# EAGLE design Rocky_Matic_mainboard (EAGLE 6.5.0)
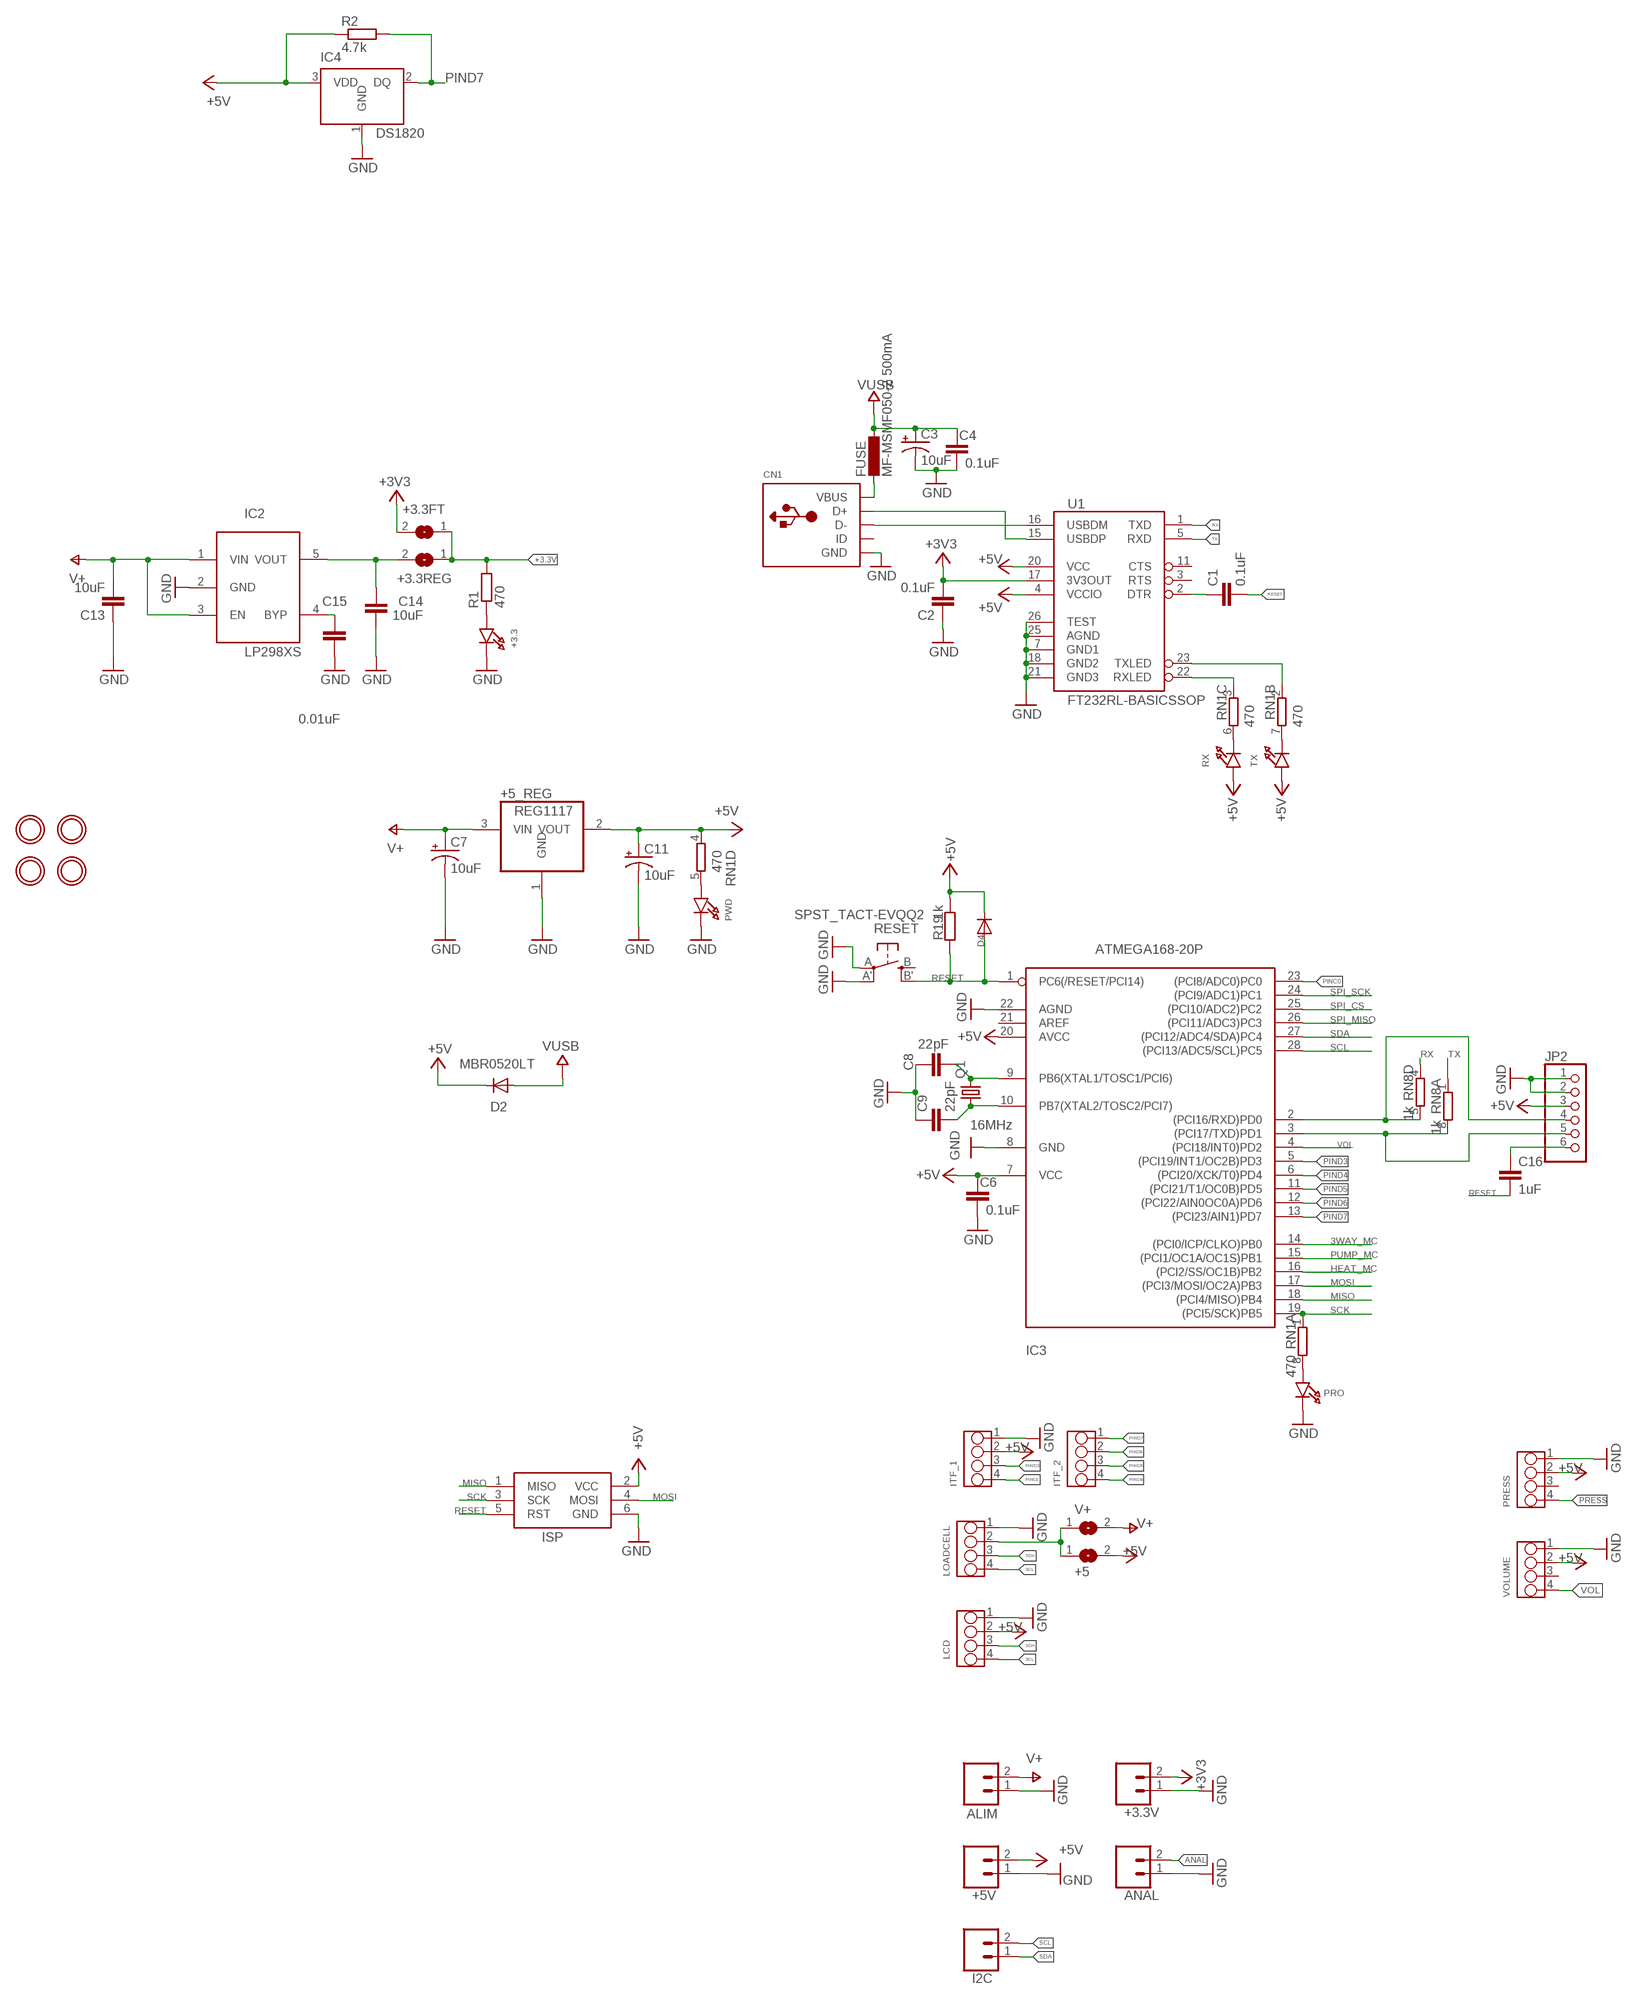
[diagram p0: schematic, sheet 1, part 1 of 2]
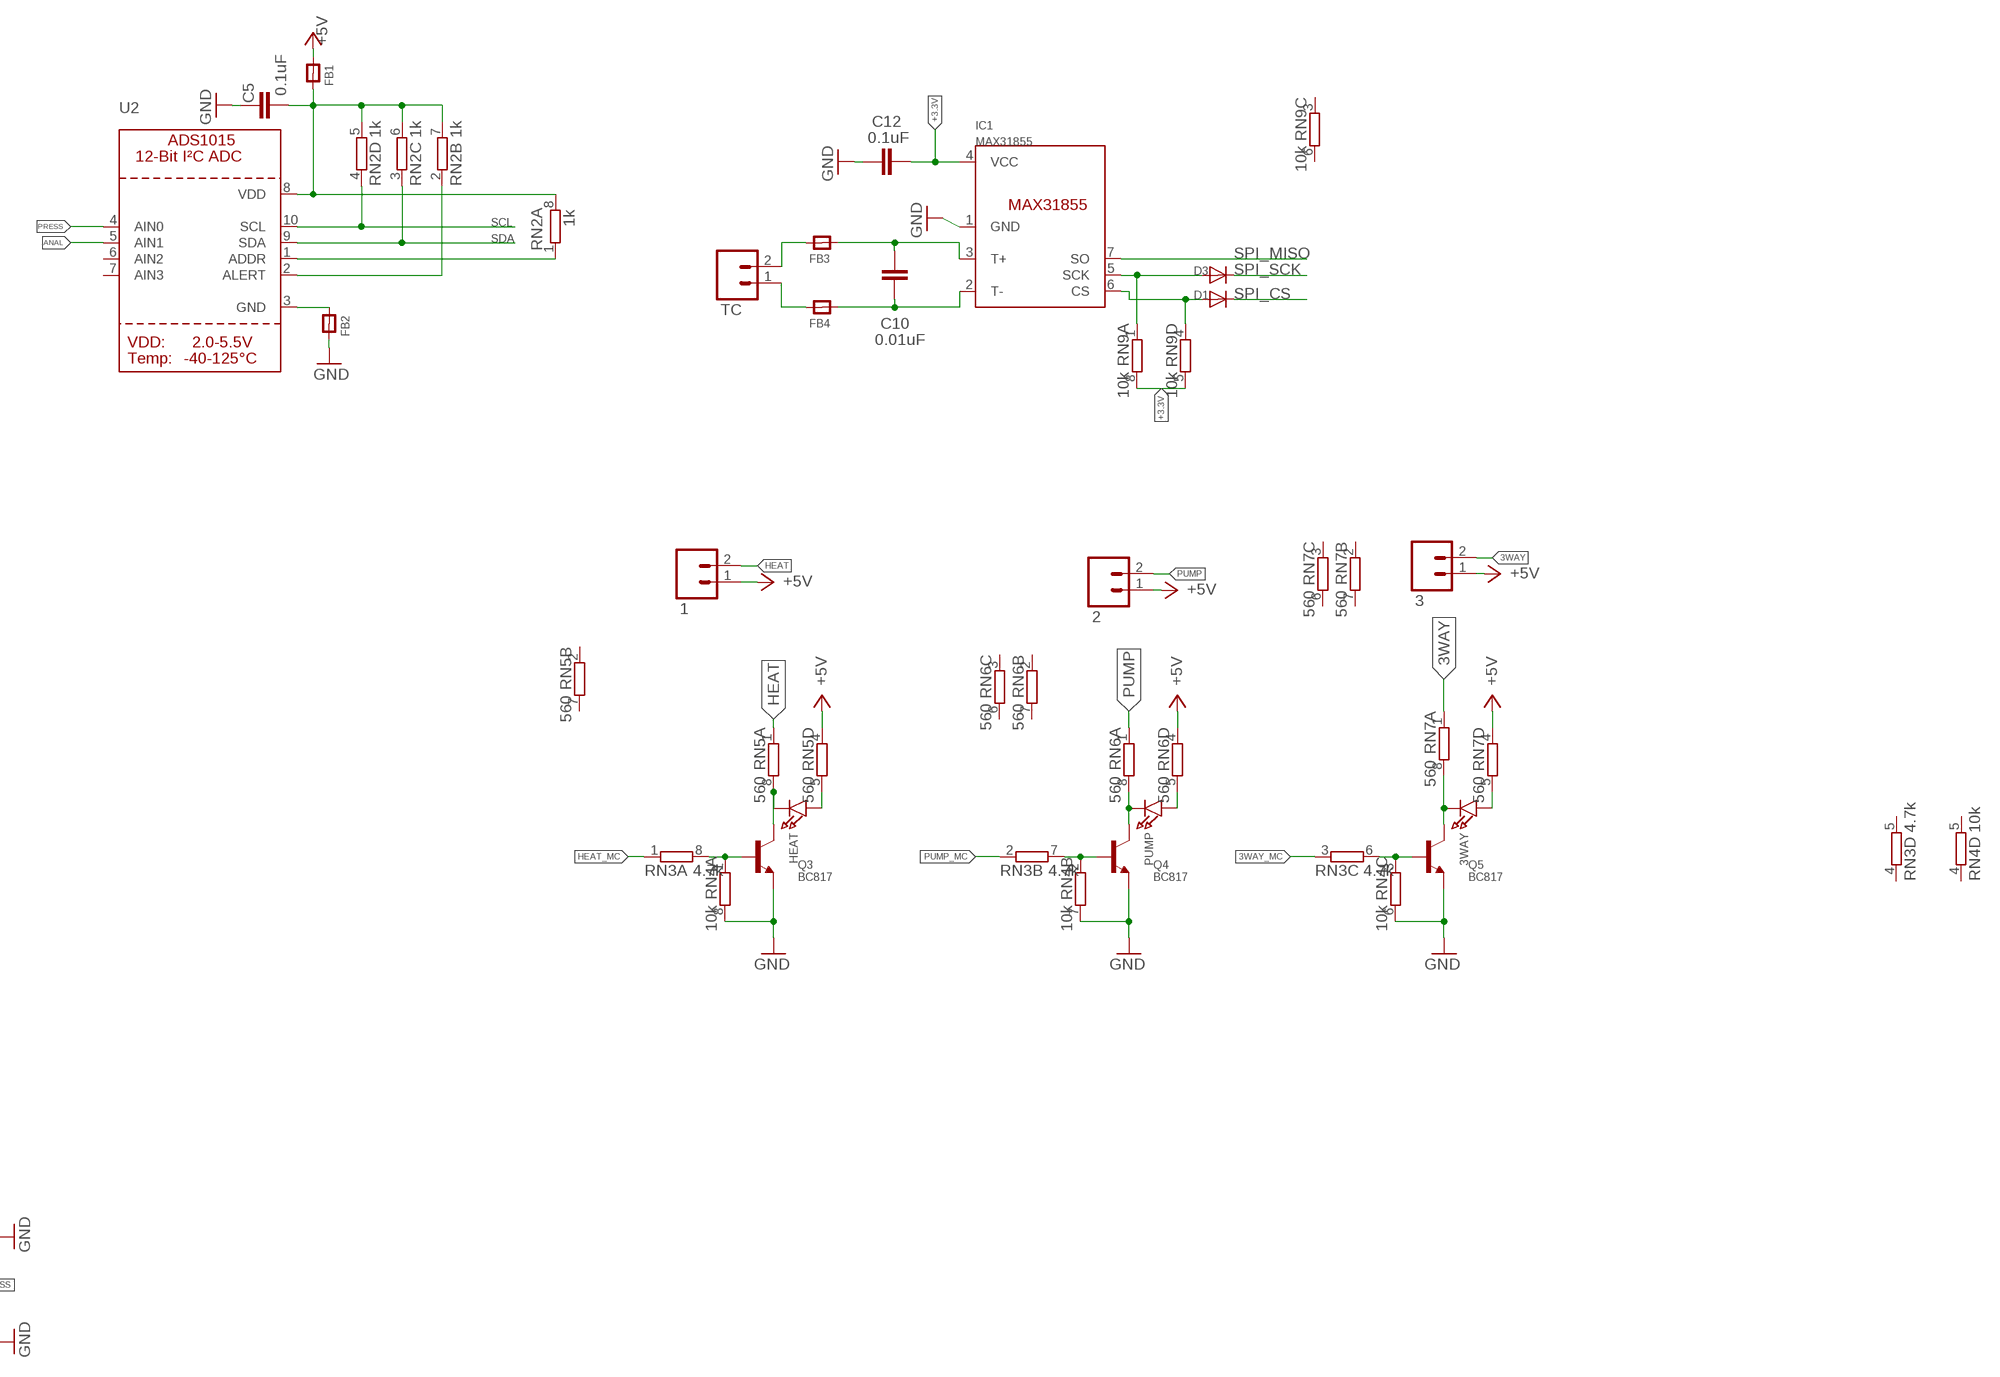
[diagram p1: schematic, sheet 1, part 2 of 2]

## Parts
1  M023.5MM  [SCREWTERMINAL-3.5MM-2]
2  M023.5MM  [SCREWTERMINAL-3.5MM-2]
3  M023.5MM  [SCREWTERMINAL-3.5MM-2]
3WAY  LED0805  [CHIPLED_0805]
+3.3  LED0805  [CHIPLED_0805]
+3.3FT  SJ  [SJ]
+3.3REG  SJ  [SJ]
+3.3V  M023.5MM  [SCREWTERMINAL-3.5MM-2]
+5  SJ  [SJ]
+5_REG  REG1117  [SOT223]
+5V  M023.5MM  [SCREWTERMINAL-3.5MM-2]
ALIM  M023.5MM  [SCREWTERMINAL-3.5MM-2]
ANAL  M023.5MM  [SCREWTERMINAL-3.5MM-2]
C1  0.1uF  C-EUC0805  [C0805]
C2  0.1uF  C-EUC0805  [C0805]
C3  10uF  10UF-16V-10%(TANT)  [EIA3216]
C4  0.1uF  C-EUC0805  [C0805]
C5  0.1uF  C-EUC0805  [C0805]
C6  0.1uF  C-EUC0805  [C0805]
C7  10uF  10UF-16V-10%(TANT)  [EIA3216]
C8  22pF  C-EUC0805  [C0805]
C9  22pF  C-EUC0805  [C0805]
C10  0.01uF  C-EUC0805  [C0805]
C11  10uF  10UF-16V-10%(TANT)  [EIA3216]
C12  0.1uF  C-EUC0805  [C0805]
C13  10uF  C-EUC0805  [C0805]
C14  10uF  C-EUC0805  [C0805]
C15  0.01uF  C-EUC0805  [C0805]
C16  1uF  C-EUC0805  [C0805]
CN1  USBMINIB  [USB-MINIB]
D1  DIODESOD-323F  [SOD-323F]
D2  MBR0520LT  [SOD123]
D3  DIODESOD-323F  [SOD-323F]
D4  DIODESOD-323F  [SOD-323F]
FB1  FERRITE_0805  [_0805]
FB2  FERRITE_0805  [_0805]
FB3  FERRITE_0805  [_0805]
FB4  FERRITE_0805  [_0805]
FUSE  MF-MSMF050-2 500mA  L-EUL1812  [L1812]
HEAT  LED0805  [CHIPLED_0805]
I2C  M023.5MM  [SCREWTERMINAL-3.5MM-2]
IC1  MAX31855  [SOIC8]
IC2  LP298XS  [SOT23-5L]
IC3  ATMEGA168-20P  [DIL28-3]
IC4  DS1820  [TO-92]
ISP  AVRISP-6  [AVRISP]
ITF_1  GROVE-4P-2.0-3470140P1  [4P-2.0-90D]
ITF_2  GROVE-4P-2.0-3470140P1  [4P-2.0-90D]
JP2  PINHD-1X6B  [1X06-BIG]
LCD  GROVE-4P-2.0-3470140P1  [4P-2.0-90D]
LOADCELL  GROVE-4P-2.0-3470140P1  [4P-2.0-90D]
PRESS  GROVE-4P-2.0-3470140P1  [4P-2.0-90D]
PRO  LED0805  [CHIPLED_0805]
PUMP  LED0805  [CHIPLED_0805]
PWD  LED0805  [CHIPLED_0805]
Q1  16MHz  CRYSTALCTS406  [CTS406]
Q3  BC817  TRANSISTOR_NPN  [SOT23-R]
Q4  BC817  TRANSISTOR_NPN  [SOT23-R]
Q5  BC817  TRANSISTOR_NPN  [SOT23-R]
R1  470  R-EU_R0805  [R0805]
R2  4.7k  R-EU_R0805  [R0805]
R19  1k  R-EU_M0805  [M0805]
RESET  SPST_TACT-EVQQ2  [EVQ-Q2]
RN1  470  4R-NCAY16  [CAY16]
RN2  1k  4R-NCAT16  [CAT16]
RN3  4.7k  4R-NCAT16  [CAT16]
RN4  10k  4R-NCAT16  [CAT16]
RN5  560  4R-NCAT16  [CAT16]
RN6  560  4R-NCAT16  [CAT16]
RN7  560  4R-NCAT16  [CAT16]
RN8  1k  4R-NCAY16  [CAY16]
RN9  10k  4R-NCAT16  [CAT16]
RX  LED0805  [CHIPLED_0805]
TC  M023.5MM  [SCREWTERMINAL-3.5MM-2]
TX  LED0805  [CHIPLED_0805]
U1  FT232RL-BASICSSOP  [SSOP28DB]
U2  ADC_ADS1015  [MSOP10]
U$1  MOUNTINGHOLE3.0THIN  [MOUNTINGHOLE_3.0_PLATEDTHIN]
U$2  MOUNTINGHOLE3.0THIN  [MOUNTINGHOLE_3.0_PLATEDTHIN]
U$3  MOUNTINGHOLE3.0THIN  [MOUNTINGHOLE_3.0_PLATEDTHIN]
U$4  MOUNTINGHOLE3.0THIN  [MOUNTINGHOLE_3.0_PLATEDTHIN]
V+  SJ  [SJ]
VOLUME  GROVE-4P-2.0-3470140P1  [4P-2.0-90D]

## Nets
3WAY: 3.2 RN7.1
3WAY_MC: IC3.14((PCI0/ICP/CLKO)PB0) RN3.3
+3.3V: +3.3FT.1 +3.3REG.1 C12.2 IC1.4(VCC) R1.2 RN9.5 RN9.8
+3V3: +3.3FT.2 +3.3V.2 C2.2 U1.17(3V3OUT)
+5V: 1.1 2.1 3.1 +5.2 +5_REG.2(VOUT) +5V.2 C6.2 C11.A(+) D2.C D4.C FB1.1 IC3.7(VCC) IC3.20(AVCC) IC4.3(VDD) ISP.2(VCC) ITF_1.2 JP2.3 LCD.2 PRESS.2 R2.1 R19.2 RN1.4 RN5.4 RN6.4 RN7.4 RX.A TX.A U1.4(VCCIO) U1.20(VCC) VOLUME.2
ANAL: ANAL.2 U2.5(AIN1)
GND: +3.3.C +3.3V.1 +5V.1 ALIM.1 ANAL.1 C2.1 C3.C(-) C4.1 C5.2 C6.1 C7.C(-) C8.1 C9.1 C11.C(-) C12.1 C13.1 C14.1 C15.1 CN1.GND FB2.2 IC1.1(GND) IC2.2(GND) IC3.8(GND) IC3.22(AGND) IC4.1(GND) ISP.6(GND) ITF_1.1 JP2.1 JP2.2 LCD.1 LOADCELL.1 PRESS.1 PRO.C PWD.C Q3.2(E) Q4.2(E) Q5.2(E) RESET.A'(P1) RESET.A(P) RN4.6 RN4.7 RN4.8 U1.7(GND1) U1.18(GND2) U1.21(GND3) U1.25(AGND) U1.26(TEST) VOLUME.1
HEAT: 1.2 RN5.1
HEAT_MC: IC3.16((PCI2/SS/OC1B)PB2) RN3.1
MISO: IC3.18((PCI4/MISO)PB4) ISP.1(MISO)
MOSI: IC3.17((PCI3/MOSI/OC2A)PB3) ISP.4(MOSI)
N$1: Q3.1(B) RN3.8 RN4.1
N$2: C8.2 IC3.9(PB6(XTAL1/TOSC1/PCI6)) Q1.3
N$3: HEAT.C Q3.3(C) RN5.8
N$4: C9.2 IC3.10(PB7(XTAL2/TOSC2/PCI7)) Q1.1
N$5: HEAT.A RN5.5
N$6: CN1.VBUS FUSE.2
N$7: Q4.1(B) RN3.7 RN4.2
N$8: PUMP.C Q4.3(C) RN6.8
N$9: PUMP.A RN6.5
N$10: RN1.7 TX.C
N$11: Q5.1(B) RN3.6 RN4.3
N$12: PWD.A RN1.5
N$13: 3WAY.C Q5.3(C) RN7.8
N$14: 3WAY.A RN7.5
N$15: RN1.6 RX.C
N$16: FB2.1 U2.3(GND)
N$17: RN1.3 U1.22(RXLED)
N$18: RN1.2 U1.23(TXLED)
N$19: CN1.D+ U1.15(USBDP)
N$20: C1.1 U1.2(DTR)
N$21: CN1.D- U1.16(USBDM)
N$22: RN2.1 U2.1(ADDR)
N$23: IC3.2((PCI16/RXD)PD0) JP2.4 RN8.5
N$24: IC3.3((PCI17/TXD)PD1) JP2.5 RN8.8
N$25: RN2.2 U2.2(ALERT)
N$26: PRO.A RN1.8
N$28: C10.1 FB3.1 IC1.3(T+)
N$29: C10.2 FB4.1 IC1.2(T-)
N$30: C5.1 FB1.2 RN2.5 RN2.6 RN2.7 RN2.8 U2.8(VDD)
N$31: FB3.2 TC.2
N$32: FB4.2 TC.1
N$33: D3.A IC1.5(SCK) RN9.1
N$34: D1.A IC1.6(CS) RN9.4
N$35: +5.1 LOADCELL.2 V+.1
N$36: +3.3.A R1.1
N$37: +3.3REG.2 C14.2 IC2.5(VOUT)
N$38: C15.2 IC2.4(BYP)
N$44: C16.1 JP2.6
PINC0: IC3.23((PCI8/ADC0)PC0) ITF_1.4
PIND3: IC3.5((PCI19/INT1/OC2B)PD3) ITF_1.3
PIND4: IC3.6((PCI20/XCK/T0)PD4) ITF_2.4
PIND5: IC3.11((PCI21/T1/OC0B)PD5) ITF_2.3
PIND6: IC3.12((PCI22/AIN0OC0A)PD6) ITF_2.2
PIND7: IC3.13((PCI23/AIN1)PD7) IC4.2(DQ) ITF_2.1 R2.2
PRESS: PRESS.4 U2.4(AIN0)
PUMP: 2.2 RN6.1
PUMP_MC: IC3.15((PCI1/OC1A/OC1S)PB1) RN3.2
RESET: C1.2 C16.2 D4.A IC3.1(PC6(/RESET/PCI14)) ISP.5(RST) R19.1 RESET.B'(S1)
RX: RN8.4 U1.1(TXD)
SCK: IC3.19((PCI5/SCK)PB5) ISP.3(SCK) RN1.1
SCL: I2C.2 IC3.28((PCI13/ADC5/SCL)PC5) LCD.4 LOADCELL.4 RN2.4 U2.10(SCL)
SDA: I2C.1 IC3.27((PCI12/ADC4/SDA)PC4) LCD.3 LOADCELL.3 RN2.3 U2.9(SDA)
SPI_CS: D1.C IC3.25((PCI10/ADC2)PC2)
SPI_MISO: IC1.7(SO) IC3.26((PCI11/ADC3)PC3)
SPI_SCK: D3.C IC3.24((PCI9/ADC1)PC1)
TX: RN8.1 U1.5(RXD)
V+: +5_REG.3(VIN) ALIM.2 C7.A(+) C13.2 IC2.1(VIN) IC2.3(EN) V+.2
VOL: IC3.4((PCI18/INT0)PD2) VOLUME.4
VUSB: C3.A(+) C4.2 D2.A FUSE.1
Unconnected: CN1.ID IC3.21(AREF) PRESS.3 RESET.B(S) RN3.4 RN3.5 RN4.4 RN4.5 RN5.2 RN5.3 RN5.6 RN5.7 RN6.2 RN6.3 RN6.6 RN6.7 RN7.2 RN7.3 RN7.6 RN7.7 RN8.2 RN8.3 RN8.6 RN8.7 RN9.2 RN9.3 RN9.6 RN9.7 U1.3(RTS) U1.11(CTS) U2.6(AIN2) U2.7(AIN3) VOLUME.3

## Power pins joined to a net without a drawn wire
GND: +5_REG.1(GND)

## Library data of the parts
1-3 +3.3V +5V ALIM ANAL I2C TC = SparkFun-Connectors:M02: Standard 2-pin 0.1" header. Use with - straight break away headers ( PRT-00116) - right angle break away headers (PRT-00553) - swiss pins (PRT-00743) - machine pins (PRT-00117) - female headers (PRT-00115) Molex polarized connector foot print use with: PRT-08233 with associated crimp pins and housings. 2.54_SCREWTERM for use with PRT-10571. 3.5mm Screw Terminal footprints for PRT-08084 5mm Screw Terminal footprints for use with PRT-08433
3WAY +3.3 HEAT PRO PUMP PWD RX TX = microbuilder:LED: LED 0603 - 0603 Surface Mount Package 2mA: Green LED - Low Power (3.9mcd, 2ma, 1.7Vf) - Digikey: 475-2709-2-ND Orange LED - Low Power (9.8mcd, 2ma, 1.8Vf) - Digikey: 475-1194-2-ND Red LED - Low Power (5mcd, 2ma, 1.8Vf) - Digikey: 475-1195-2-ND Yellow LED - Low Power (7mcd, 2ma, 1.8Vf) - Digikey: 475-1196-2-ND 5mA: Blue LED - Low Power (17mcd, 5ma, 2.9Vf) - Digikey: LNJ937W8CRACT-ND 0805 - 0805 Surface Mount Package 2mA: Red LED (8.8mcd, 2mA, 1.8Vf, Clear) - Low Power [Digikey: 475-2510-1-ND] Green LED (5mcd, 2mA, 1.8Vf, Clear) - Low Power [Digikey: 475-2730-1-ND] Yellow LED (11.3mcd, 2mA, 1.8Vf, Clear) - Low Power [Digikey: 475-2555-1-ND] 20mA: Red LED (104mcd, 20mA, Diffused) - LS R976 [Digikey: 475-1278-6-ND] Red LED (12mcd, 20mA, 2.0Vf, Clear) - APT2012EC [Digikey: 754-1128-1-ND] Green LED (15mcd, 20mA, 2.2Vf, Clear) - APT2012GC [Digikey: 754-1131-1-ND] Orange LED (160mcd, 20mA, 2.1Vf, Clear) - APT2012SECK [Digikey: 754-1130-1-ND] 1206 - 1206 Surface Mount Package Green LED (26mcd, 20mA, Diffused) - LG N971 [Digikey: 475-1407-6-ND] Red LED (15mcd, 20mA, Diffused) - LH N974 [Digikey: 475-1416-6-ND]
+3.3FT +3.3REG +5 V+ = jumper:SJ: SMD solder JUMPER
+5_REG = burr-brown:REG1117: 800mA and 1A Low Dropout (LDO) Positive Regulator 1.8V, 2.5V, 2.85V, 3.3V, 5V, and Adj; MPN: REG1117; OC_FARNELL: 1097566; OC_NEWARK: 14P6981
C1 C2 C4-C6 C8-C10 C12-C16 = rcl:C-EU: CAPACITOR, European symbol
C3 C7 C11 = SparkFun-Capacitors:10UF-16V-10%(TANT): CAP-00811 1206/EIA-3216 Tantalum capacitor; PROD_ID: CAP-00811
CN1 = adafruit:USB: USB Connectors USBMINIB - Surface Mount Female Mini-B USB Connector 4UConnector: 06564 By microbuilder.eu Thru-hole RA Female Mini-B USB Connector 4UConnector: 18732 By ladyada.net
D1 D3 D4 = adafruit:DIODE: Diode SMADIODE - SMA Surface Mount Package 20V 1A Schottky Diode Digikey: 641-1014-6-ND DO-1N4148 - Through Hole Small Current Diode SOD-123 20V 1 A (.5mV Vf) Schottky Diode - Digikey: MBRX120TPMSCT-ND SOD-323 10V 570mA (.38mV Vf, 3ns) Schottky Diode - Digikey: ZLLS410CT-ND SOD-523 30V 30mA Schottky Diode (RB751S-40TE61) - Digikey: RB751S-40TE61CT-ND SOT23-R/W - SOT23 Package (R = Solder Paste/Reflow Ovens, W = Hand-Soldering) BAT54Film 40V 300mA - Digikey: 497-7162-1-ND
D2 = diode:MBR0520LT: SCHOTTKY BARRIER RECTIFIER Source: http://onsemi.com .. MBR0520LT1-D.pdf
FB1-FB4 = microbuilder:FERRITE: Ferrite Bead 0603 MMZ1608B121C - 120 Ohm @ 100MHz, 600mA, 0.15 Ohm DC Resistance - Digikey: 445-2164-1-ND BK1608HW121-T - 120 Ohm, 600mA Ferrite Chip - Digikey: 587-1876-2-ND 0805 HZ0805B272R-10 - 2.7K Ohm @ 100MHz, 200mA, 0.8 Ohm DC Resistance - Digikey: 240-2504-1-ND (see also Murata BLM21BD272SN1L) MMZ2012Y152B - 1.5K Ohm @ 100MHz, 500mA, 0.4 Ohm DC Resistance - Digikey: 445-1560-1-ND - Mainly for high frequency (80-400MHz) MMZ2012R102A - 1K Ohm @ 100MHz, 500mA, 0.3 Ohm DC Resistance - Digikey: 445-1555-2-ND - More general purpose (10-200MHz)
FUSE = rcl:L-EU: INDUCTOR, European symbol
IC1 = AlexW-Eagle-Libraries:MAX31855
IC2 = adafruit:LP298X
IC3 = adafruit:ATMEGA168*P: MICROCONTROLLER 16 kBytes FLASH 1 kBytes SRAM 512 Bytes EEPROM USART 8-channel 10 bit ADC
IC4 = DS1820:DS1820: DS1820 - 1-Wire Digital Thermometer
ISP = adafruit:AVRISP: AVR ISP HEADER Standard 6 pin header for AVR programming
ITF_1 ITF_2 LCD LOADCELL PRESS VOLUME = OPL Eagle Library:GROVE-4P-2.0
JP2 = adafruit:PINHD-1X6: PIN HEADER
Q1 = adafruit:CRYSTAL: CRYSTAL; OC_FARNELL: unknown; OC_NEWARK: unknown
Q3-Q5 = microbuilder:TRANSISTOR_NPN: NPN Transistor Transistor (NPN) 500mA 45V - BC817 [Digikey: 568-1631-1-ND] Transistor (NPN) 500mA 45V - BC817,215 [Mouser: 771-BC817-T/R] SOT23-R - SOT23 footprint optimised for use with solder paste and reflow ovens. SOT23-W - SOT23 footprint optimised for hand-soldering (larger pads).
R1 R2 R19 = rcl:R-EU_: RESISTOR, European symbol
RESET = adafruit:SPST_TACT: SMT 6mm switch, EVQQ2 series http://www.ladyada.net/library/eagle
RN1-RN9 = resistor-dil:4R-N: Array Chip Resistor Source: RS Component / Phycomp; OC_FARNELL: unknown; OC_NEWARK: unknown
U1 = SparkFun-DigitalIC:FT232RL-BASIC: USB UART This is the simplified version of the FT232RL unit. Only what you need, nothing you don't. Spark Fun Electronics SKU : COM-00650
U2 = microbuilder:ADC_ADS1015: ADS1015 - 12-bit 4-Channel I2C ADC with Internal PGA VDD: 2.0-5.5V Sampling Rate: 3.3ksps Gain Settings: 2/3, 1, 2, 4, 8, 16 I2C Address: ADDR low = 1001000x, ADDR high = 1001001x Internal Comparator The ADS1015 includes an internal comparator that can be set to output a high-level on ALERT when the conversion results exceeeds a pre-defined upper level, and will deassert itself when the level falls below a pre-defined lower threshold level. It can also be set to windowed mode where the ALERT pin will be asserted if the data exceeds the upper threshold or falls below the lower threshold.
U$1-U$4 = microbuilder:MOUNTINGHOLE: Mounting Hole For #2 screws (0.086"/2.18mm width, 0.094"/2.4mm hole) use 2.5mm

## Board
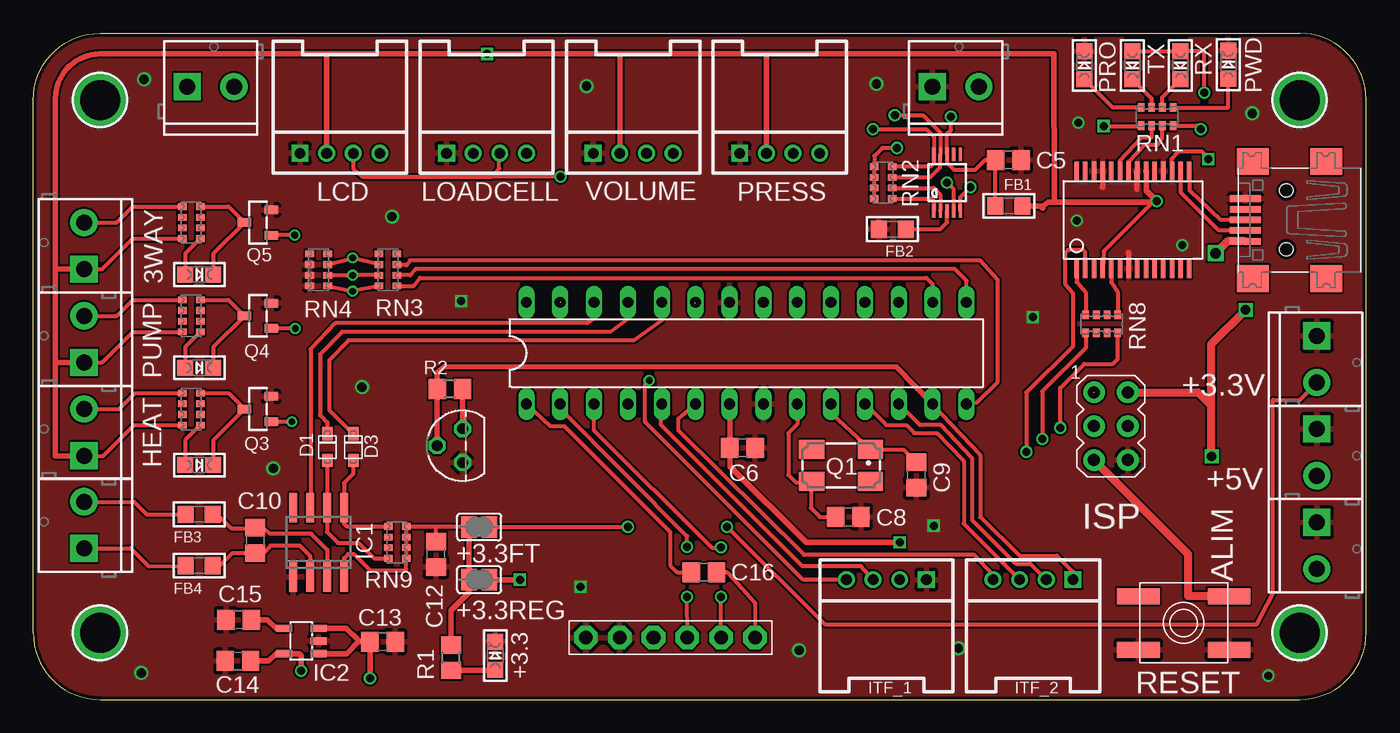
[diagram p2: board, top side]
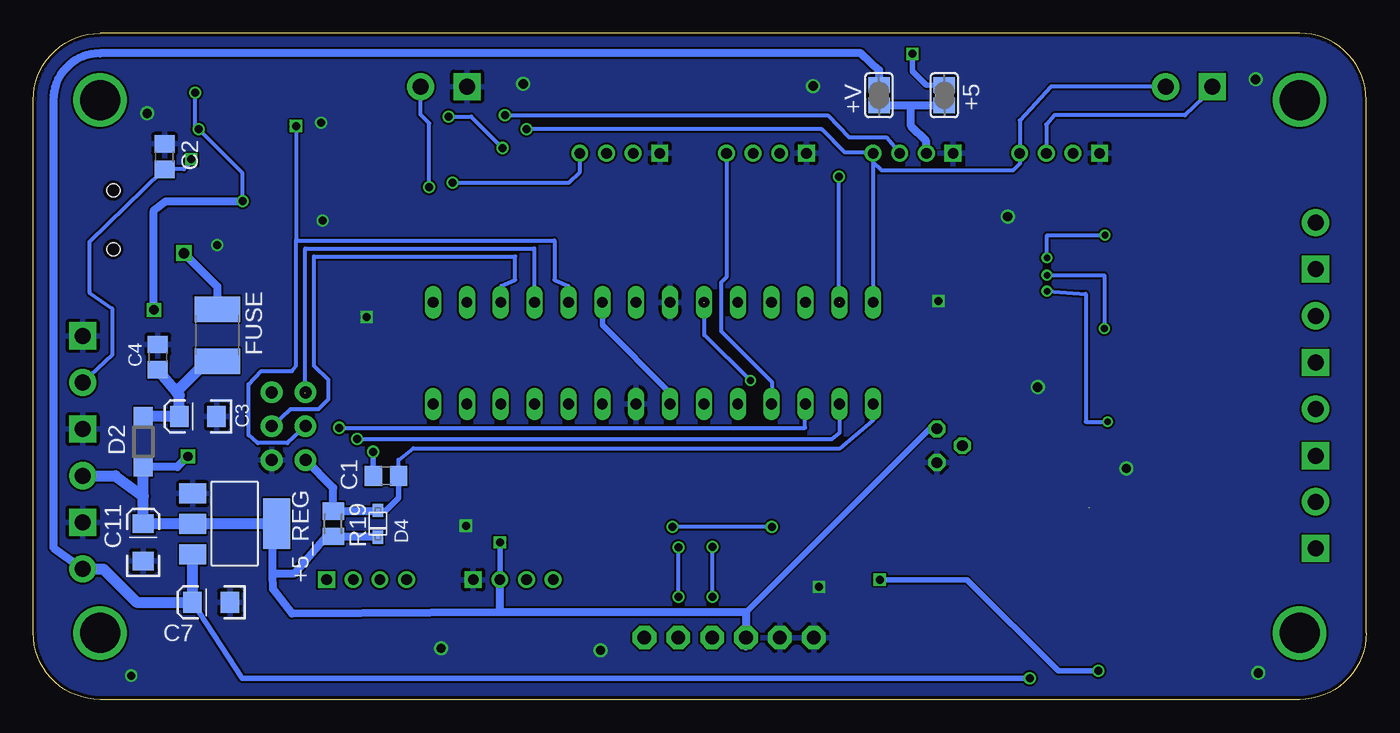
[diagram p3: board, bottom side, seen from below]

Size 100 x 50 mm. Coordinates in mm from the lower left corner, seen from the top.
Outline: 5,0 95,0 arc90 100,5 100,45 arc90 95,50 5,50 arc90 0,45 0,5 arc90 5,0
Copper layers (1*2*15*16): Top 0.035mm / dielectric 0.2mm / Route2 0.0175mm / dielectric 1.1mm / Route15 0.0175mm / dielectric 0.2mm / Bottom 0.035mm
Design rules "SeeedStudio_DRU_no_angle_20130527": minimum track width 6mil, minimum drill 12mil, track to track 6mil, track to pad 6mil, pad to pad 6mil, via to via 6mil, smd to smd 0mil, copper to edge 10mil, drill to drill 10mil, minimum pad ring 6mil, minimum via ring 6mil, stop-mask expansion 2mil, vias tented up to drill 25mil, thermal gap 10mil

### Footprints (pad centres in the part's own frame; a part is rotated, then mirrored left to right if it is on the bottom)
SCREWTERMINAL-3.5MM-2 = drill 1.2 pad 2.032 square: 1 0,0 | drill 1.2 pad 2.032: 2 3.5,0
CHIPLED_0805 = smd 1.2 x 1.2: A 0,-1.05; C 0,1.05
SJ = smd 1.168 x 1.6: 1 -0.762,0; 2 0.762,0
SOT223 = smd 1.499 x 2.007: 1 -2.261,-3.15; 2 0.025,-3.15; 3 2.311,-3.15 | smd 3.81 x 2.007: 4 0,3.15
C0805 = smd 1.3 x 1.5: 1 -0.95,0; 2 0.95,0
EIA3216 = smd 1.4 x 1.6: A 1.4,0; C -1.4,0
USB-MINIB = smd 0.5 x 2.308: D+ 0,4.064; D- -0.8,4.064; GND 1.6,4.064; ID 0.8,4.064; VBUS -1.6,4.064 | smd 2 x 2.4: GND1 -4.4,-2; GND2 -4.4,3.5; GND3 4.4,3.5; GND4 4.4,-2 | hole 1: -2.2,1; 2.2,1
SOD-323F = smd 1 x 0.8: A -1,0; C 1,0
SOD123 = smd 1.4 x 1.4: A 1.9,0; C -1.9,0
_0805 = smd 1.2 x 1.3: 1 -1.016,0; 2 1.016,0
L1812 = smd 1.9 x 3.4: 1 -1.95,0; 2 1.95,0
SOIC8 = smd 0.6 x 2.2: 1 -1.905,-2.6; 2 -0.635,-2.6; 3 0.635,-2.6; 4 1.905,-2.6; 5 1.905,2.6; 6 0.635,2.6; 7 -0.635,2.6; 8 -1.905,2.6
SOT23-5L = smd 0.55 x 1.2: 1 -0.95,-1.3; 2 0,-1.3; 3 0.95,-1.3; 4 0.95,1.3; 5 -0.95,1.3
DIL28-3 = drill 0.813 long: 1 -16.51,-3.81; 2 -13.97,-3.81; 3 -11.43,-3.81; 4 -8.89,-3.81; 5 -6.35,-3.81; 6 -3.81,-3.81; 7 -1.27,-3.81; 8 1.27,-3.81; 9 3.81,-3.81; 10 6.35,-3.81; 11 8.89,-3.81; 12 11.43,-3.81; 13 13.97,-3.81; 14 16.51,-3.81; 15 16.51,3.81; 16 13.97,3.81; 17 11.43,3.81; 18 8.89,3.81; 19 6.35,3.81; 20 3.81,3.81; 21 1.27,3.81; 22 -1.27,3.81; 23 -3.81,3.81; 24 -6.35,3.81; 25 -8.89,3.81; 26 -11.43,3.81; 27 -13.97,3.81; 28 -16.51,3.81
TO-92 = drill 0.813 pad 1.27 octagon: 1 -1.27,0; 2 0,1.905; 3 1.27,0
AVRISP = drill 0.9 pad 1.626: 1 -1.27,2.54; 2 1.27,2.54; 3 -1.27,0; 4 1.27,0; 5 -1.27,-2.54; 6 1.27,-2.54
4P-2.0-90D = drill 0.8 pad 1.27 square: 1 -3,0 | drill 0.8 pad 1.27: 2 -1,0; 3 1,0; 4 3,0
1X06-BIG = drill 1.016 pad 1.778 octagon: 1 -6.35,0; 2 -3.81,0; 3 -1.27,0; 4 1.27,0; 5 3.81,0; 6 6.35,0
CTS406 = smd 1.9 x 1.4: 1 -2.2,-1.2; 2 2.2,-1.2; 3 2.2,1.2; 4 -2.2,1.2
SOT23-R = smd 0.635 x 1.016: 1 -0.95,-1; 2 0.95,-1; 3 0,1
R0805 = smd 1.3 x 1.5: 1 -0.95,0; 2 0.95,0
M0805 = smd 1.3 x 1.6: 1 -0.95,0; 2 0.95,0
EVQ-Q2 = smd 3.2 x 1.2: A -3.4,-2; A' 3.4,-2; B -3.4,2; B' 3.4,2
CAY16 = smd 0.5 x 0.65: 1 -1.2,-0.675; 2 -0.4,-0.675; 3 0.4,-0.675; 4 1.2,-0.675; 5 1.2,0.675; 6 0.4,0.675; 7 -0.4,0.675; 8 -1.2,0.675
CAT16 = smd 0.5 x 0.65: 1 -1.2,-0.675; 2 -0.4,-0.675; 3 0.4,-0.675; 4 1.2,-0.675; 5 1.2,0.675; 6 0.4,0.675; 7 -0.4,0.675; 8 -1.2,0.675
SSOP28DB = smd 0.348 x 1.397: 1 -4.225,-3.656; 2 -3.575,-3.656; 3 -2.925,-3.656; 4 -2.275,-3.656; 5 -1.625,-3.656; 6 -0.975,-3.656; 7 -0.325,-3.656; 8 0.325,-3.656; 9 0.975,-3.656; 10 1.625,-3.656; 11 2.275,-3.656; 12 2.925,-3.656; 13 3.575,-3.656; 14 4.225,-3.656; 15 4.225,3.656; 16 3.575,3.656; 17 2.925,3.656; 18 2.275,3.656; 19 1.625,3.656; 20 0.975,3.656; 21 0.325,3.656; 22 -0.325,3.656; 23 -0.975,3.656; 24 -1.625,3.656; 25 -2.275,3.656; 26 -2.925,3.656; 27 -3.575,3.656; 28 -4.225,3.656
MSOP10 = smd 0.25 x 1: 1 -1,-2.113; 2 -0.5,-2.113; 3 0,-2.113; 4 0.5,-2.113; 5 1,-2.113; 6 1,2.113; 7 0.5,2.113; 8 0,2.113; 9 -0.5,2.113; 10 -1,2.113
MOUNTINGHOLE_3.0_PLATEDTHIN = drill 3 pad 3.6: P$1 0,0

### Placement (x,y rotation side)
1  3.8,18.3 90 top
2  3.8,25.3 90 top
3  3.8,32.3 90 top
3WAY  12.45,31.9 270 top
+3.3  34.65,3.3 0 top
+3.3FT  33.45,12.95 0 top
+3.3REG  33.45,9 0 top
+3.3V  96.3,27.3 270 top
+5  31.65,45.35 90 bottom
+5_REG  84.9,13.2 270 bottom
+5V  96.3,20.3 270 top
ALIM  96.3,13.3 270 top
ANAL  67.45,46 0 top
C1  73.55,16.8 0 bottom
C2  90.15,40.75 270 bottom
C3  87.65,21.25 180 bottom
C4  90.65,25.7 270 bottom
C5  73.15,40.5 0 top
C6  53.2,18.9 180 top
C7  86.65,7.3 180 bottom
C8  61.15,13.71 180 top
C9  66.24,16.85 90 top
C10  16.65,11.95 270 top
C11  91.75,11.8 90 bottom
C12  30.2,10.9 90 top
C13  26.2,4.35 180 top
C14  15.35,2.9 0 top
C15  15.4,6 0 top
C16  50.3,9.55 180 top
CN1  95,36 90 top
D1  22.05,18.95 90 top
D2  91.75,19.35 90 bottom
D3  24,18.95 90 top
D4  74.15,13.2 270 bottom
FB1  73.2,37.05 180 top
FB2  64.45,35.3 180 top
FB3  12.45,13.9 180 top
FB4  12.45,10.05 180 top
FUSE  86.2,27.35 90 bottom
HEAT  12.45,17.6 270 top
I2C  11.55,46 0 top
IC1  21.4,11.8 0 top
IC2  20.1,4.4 90 top
IC3  53.5,26 0 top
IC4  32.2,19.05 90 top
ISP  80.85,20.51 0 top
ITF_1  64,9 180 top
ITF_2  75,9 180 top
JP2  47.8,4.65 0 top
LCD  23,41 0 top
LOADCELL  34,41 0 top
PRESS  56,41 0 top
PRO  78.85,47.6 0 top
PUMP  12.45,24.9 270 top
PWD  89.65,47.65 0 top
Q1  60.6,17.57 180 top
Q3  16.85,21.8 90 top
Q4  16.85,28.8 90 top
Q5  16.85,35.8 90 top
R1  31.35,3.15 90 top
R2  31.25,23.3 180 top
R19  77.5,13.2 270 bottom
RESET  86.3,5.75 0 top
RN1  84.3,43.75 0 top
RN2  63.75,38.8 90 top
RN3  26.6,32.25 90 top
RN4  21.4,32.25 90 top
RN5  11.85,21.8 270 top
RN6  11.85,28.8 270 top
RN7  11.85,35.8 270 top
RN8  80.15,28.2 180 top
RN9  27.3,11.8 270 top
RX  86.05,47.6 180 top
TC  3.8,11.35 90 top
TX  82.45,47.6 180 top
U1  82.5,36 0 top
U2  68.55,38.8 0 top
U$1  95,45 0 top
U$2  5,45 0 top
U$3  95,5 0 top
U$4  5,5 0 top
V+  36.55,45.35 90 bottom
VOLUME  45,41 0 top

### Tracks (layer width: path | path; a pad name or v marks a point on that pad's centre or on a via)
3WAY
  Top 0.305: 3.2 6.25,35.8 7.45,37 RN7.1
3WAY_MC
  Top 0.305: IC3.14 70.79,22.29 72.35,23.85 72.35,31.5 71.05,32.95 28.25,32.95 28,32.6 27.32,32.6 RN3.3
+3.3V
  Top 0.305: IC1.4 23.3,10.6 23.6,10.9 24.05,10.9 25.3,9.65 27.85,9.65 27.98,9.78 RN9.5 RN9.8 28.02,12.95 30.25,12.95 | +3.3FT.1 30.25,12.95 | C12.2 30.2,12.9 30.25,12.95
  Top 0.406: +3.3FT.1 +3.3REG.1 | 32.7,8.99 +3.3REG.1 | +3.3REG.1 32.69,8.04 31.35,6.7 R1.2
+3V3  (via drill 0.6)
  Top 0.305: 85.4,39.68 U1.17 85.42,40.58 85.95,41.15 87.65,41.15 v88.15,40.55 | +3.3FT.2 v44.6,12.95 | v52.05,12.95 59.4,5.65 91.8,5.65 93,7.95 93,22.5 95,22.5 +3.3V.2
  Bottom 0.305: v88.15,40.55 88.15,40.35 88.7,39.8 C2.2 90.35,39.65 95.8,34.35 95.8,30.55 94.1,29.35 94.1,25.85 +3.3V.2 | v44.6,12.95 v52.05,12.95
+5V  (via drill 0.6, 0.7)
  Top 0.305: TX.A RX.A 87.85,48.65 v87.85,45.55 | RN1.4 87.33,43.08 v87.6,42.8 | v84.3,37.4 84.05,37.4 80.3,33.65 80.25,32.37 U1.4 | 3.1 5.15,32.3 7.45,34.6 RN7.4 | 2.1 5.15,25.3 7.45,27.6 RN6.4 | 1.1 5.25,18.3 7.55,20.6 RN5.4 | 1.75,32.3 1.65,32.2
  Top 0.406: v84.3,37.4 83.5,38.2 83.5,39.63 U1.20 | 22,48.45 5,48.45 arc90 1.65,45.1 1.65,32.2 1.65,25.3 | 22,48.45 v34.05,48.45 43.95,48.45 | 43.95,48.45 55,48.45 | 55,48.45 76.55,48.45 76.6,37.35 | 1.65,25.3 1.65,18.3 1.1 | 3.1 1.75,32.3 | 2.1 1.65,25.3 | v65,11.8 58,11.8 52.25,17.5 C6.2 52.25,22.28 IC3.7 | 76.6,37.35 84.3,37.35 | LCD.2 22,48.45 | VOLUME.2 44,48.4 43.95,48.45 | PRESS.2 55,48.45 | FB1.1 75.6,37.05 | 75.6,37.05 75.75,37.05 76.15,37.35 76.6,37.35 | 75.75,36.9 75.6,37.05 | IC4.3 R2.1
  Top 0.61: ISP.2 87.4,23.05 88.35,22.1 | 88.35,22.1 88.35,18.3 v88.4,18.25 | v90.95,29.25 88.35,26.65 88.35,22.1 | 84.3,37.35 v84.3,37.4
  Bottom 0.305: v84.3,37.4 84.3,39.5 v87.6,42.8 87.85,43.05 v87.85,45.55 | 88,13.2 +5_REG.2
  Bottom 0.406: ITF_1.2 v65,11.8 | IC3.7 52.24,22.99 57.3,28.1 IC3.20 | +5.2 33.01,46.11 34.05,47.15 v34.05,48.45 | IC4.3 32.78,20.32 46.55,6.55 | 57.3,29.83 IC3.20 | IC3.20
  Bottom 0.61: 91.72,13.18 C11.A | v90.95,29.25 90.95,36.7 90.05,37.4 v84.3,37.4 | 65,6.55 80.6,6.45 82.01,8.28 82.05,9.45 | 82.05,9.45 82,13.2 | v88.4,18.25 89.2,17.45 D2.C | 65,6.55 ITF_1.2 | 82.05,9.45 80.45,9.45 78.05,12.25 R19.2 74.2,12.25 D4.C | 65,6.55 46.55,6.55 46.55,3.97 JP2.3
  Bottom 0.813: +5_REG.2 91.72,13.18 | C11.A 91.75,15.25 | 91.75,15.25 D2.C | 82,13.2 88,13.2 | +5V.2 93.85,16.8 91.75,15.25
ANAL  (via drill 0.6)
  Top 0.305: U2.5 69.55,37.7 v70.3,38.45
  Bottom 0.305: v70.3,38.45 70.3,43.25 70.95,43.9 ANAL.2
GND  (via drill 0.6, 0.7)
  Top 0.406: U1.25 80.22,38.48 80.2,38.45 | U1.7 82.17,33.52 82.15,33.55 | U1.18 | U1.21 82.8,39.66 82.8,38.3
  other vias: 8.3,46.55 41.5,46.05 63.25,46.2 91.45,44 8.1,2 18,17.35 78.4,43.3 78.3,35.95 86.2,34.1 92.65,1.8 24.65,23.45 26.9,36.25 57.45,3.7 69.4,3.85 75,28.7 67.55,13.05 32.1,29.9 41.05,8.45
  pour Top: -2.54,53.34 -2.54,-2.54 104.14,-2.54 104.14,53.34
  pour Bottom: -5.08,55.88 -5.08,-5.08 106.68,-5.08 106.68,55.88
HEAT
  Top 0.305: 1.2 6.45,21.8 7.65,23 RN5.1
HEAT_MC
  Top 0.305: RN3.1 28.55,31.05 29,31.65 67,31.65 67.45,31.2 67.45,29.81 IC3.16
MISO  (1 unrouted)
  Bottom 0.254: 62.4,29.86 IC3.18
  Bottom 0.305: 79.6,23 79.6,33.85 62.4,33.85 62.4,29.86
MOSI
  Bottom 0.305: ISP.4 82.04,20.51 80.7,21.8 78.6,21.8 77.85,22.55 77.85,24 78.95,25.05 78.95,33.25 63.85,33.25 63.85,31.5 64.9,31.05 64.9,29.81 IC3.17
N$1  (via drill 0.5)
  Top 0.305: RN4.1 v23.95,30.65 RN3.8 | v19.4,20.85 Q3.1
  Bottom 0.305: v23.95,30.65 21.05,30.45 21.05,20.85 v19.4,20.85
N$2
  Top 0.305: IC3.9 57.32,20.67 56.65,20 56.65,16.85 57.2,16.3 58.33,16.3 | 58.33,16.3 Q1.3 | 58.33,16.3 58.33,14.37 59,13.7 60.19,13.7 C8.2
N$3
  Top 0.305: RN5.8 14.65,23 Q3.3 13.5,19.45 HEAT.C
N$4
  Top 0.305: C9.2 65.28,18.77 Q1.1 59.86,21.51 IC3.10
N$5
  Top 0.305: RN5.5 11.4,19.48 HEAT.A
N$6  (via drill 0.8)
  Top 0.61: CN1.VBUS 89.6,34.4 v88.7,33.5
  Bottom 0.61: v88.7,33.5 86.2,31 FUSE.2
N$7  (via drill 0.5)
  Top 0.305: RN4.2 v23.95,31.85 RN3.7 | v19.65,27.85 Q4.1
  Bottom 0.305: v23.95,31.85 19.65,31.85 v19.65,27.85
N$8
  Top 0.305: RN6.8 14.65,30 Q4.3 13.5,26.45 PUMP.C
N$9
  Top 0.305: RN6.5 11.4,26.48 PUMP.A
N$10
  Top 0.305: RN1.7 83.9,45.1 TX.C
N$11  (via drill 0.5)
  Top 0.305: RN4.3 v23.95,33.15 RN3.6 | v19.6,34.85 Q5.1
  Bottom 0.305: v23.95,33.15 23.95,34.85 v19.6,34.85
N$12
  Top 0.305: RN1.5 89.65,44.42 PWD.A
N$13
  Top 0.305: RN7.8 14.65,37 Q5.3 13.5,33.45 3WAY.C
N$14
  Top 0.305: RN7.5 11.4,33.48 3WAY.A
N$15
  Top 0.305: RN1.6 84.7,45.2 RX.C
N$16
  Top 0.305: FB2.1 68.05,35.3 68.55,35.8 U2.3
N$17
  Top 0.305: U1.22 82.18,40.37 83.38,41.65 84.4,41.65 84.7,42.1 RN1.3
N$18
  Top 0.305: U1.23 81.52,40.45 83.17,42.2 83.9,42.2 RN1.2
N$19
  Top 0.305: CN1.D+ 89.1,36 86.75,38.2 86.75,39.58 U1.15
N$20  (via drill 0.6)
  Top 0.305: U1.2 78.92,33.58 78.75,33.75 77.65,33.75 77.4,33.5 77.4,31.2 78,30.5 78,26.5 74.5,23.05 v74.5,18.6
  Bottom 0.406: C1.1 v74.5,18.6
N$21
  Top 0.305: CN1.D- 88.95,35.2 86.1,38.05 86.1,39.63 U1.16
N$22
  Top 0.305: RN2.1 67.35,37.6 67.55,37.4 U2.1
N$23  (via drill 0.6)
  Top 0.305: v75.7,19.55 75.7,23.15 78.95,26.4 RN8.5 | JP2.4 v49.05,7.7 | v49.05,11.45 49.05,12.25 39.55,21.8 39.55,22.17 IC3.2
  Bottom 0.305: v75.7,19.55 40.1,19.55 39.5,20.05 39.5,22.2 IC3.2 | v49.05,7.7 v49.05,11.45
N$24  (via drill 0.6)
  Top 0.305: v77.05,20.4 77.05,23.4 78.85,25.2 81,25.2 81.35,25.55 RN8.8 | 51.61,4.54 JP2.5 v51.61,7.69 v51.6,7.7 | IC3.3 42.05,22.17 42.05,20.2 50.9,11.4 51.57,11.4 v51.6,11.43
  Bottom 0.305: v77.05,20.4 42.1,20.4 42.1,22.16 IC3.3 | v51.6,7.7 v51.6,11.43
N$25
  Top 0.305: RN2.2 67.55,38.4 68.05,37.9 U2.2
N$26
  Top 0.305: RN1.8 80.97,44.42 PRO.A
N$28
  Top 0.305: FB3.1 13.8,13.9 14.85,12.85 15.95,12.85 | 15.95,12.85 16.5,12.85 | 16.5,12.85 C10.1 15.95,12.85 | IC1.3 22.05,9.21 22.05,11.25 20.85,12.45 17.75,12.45 17.25,12.85 16.5,12.85
N$29
  Top 0.305: FB4.1 13.95,10 14.95,11 C10.2 17.3,11 17.8,11.55 20,11.55 20.75,10.8 20.75,9.21 IC1.2
N$30  (via drill 0.6)
  Top 0.254: RN2.7 RN2.6 RN2.5
  Top 0.305: RN2.7 RN2.8 63.15,37.52 | 63.05,40.02 RN2.5 | FB1.2 72.18,40.48 C5.1 71.4,40.5 70.65,39.75 69.1,39.75 68.55,40.3 U2.8 68.55,42.45 68.85,42.75 v68.85,43.75 | RN2.5 63.08,37.73 | v64.8,41.4 63.7,41.4 63.1,40.8 63.1,40.02 RN2.5
  Bottom 0.305: v68.85,43.75 67.15,43.75 v64.8,41.4
N$31
  Top 0.305: TC.2 7.55,14.85 8.5,13.9 FB3.2
N$32
  Top 0.305: TC.1 7.3,11.35 8.65,10 FB4.2
N$33
  Top 0.305: IC1.5 23.3,13.9 | 23.3,13.9 23.3,13.2 23.5,13 RN9.1 | D3.A 24,16.95 23.3,16.25 23.3,13.9
N$34
  Top 0.305: RN9.4 25.55,10.6 24.4,11.75 22.85,11.75 22.04,12.56 IC1.6 22.05,14.41 D1.A
N$35
  Bottom 0.61: V+.1 34.15,44.59 | 34.15,44.59 +5.1 | LOADCELL.2 33,41.9 34.15,43.05 34.15,44.59
N$36
  Top 0.406: R1.1 34.6,2.2 +3.3.A
N$37  (via drill 0.6)
  Top 0.305: 34.25,8.96 +3.3REG.2
  Top 0.406: v36.5,9 +3.3REG.2 | v20.1,2.15 20.1,3.3 19.95,3.45 IC2.5 18.2,3.45 17.65,2.9 C14.2
  Bottom 0.406: v36.5,9 29.95,9 23.1,2.15 v20.1,2.15
N$38
  Top 0.406: C15.2 17.55,6 18.2,5.35 IC2.4
N$44
  Top 0.305: JP2.6 54.15,7.25 52.07,9.53 51.27,9.53 C16.1
PINC0  (via drill 0.5)  (1 unrouted)
  Top 0.305: ITF_1.4 57.75,9 45.9,20.85 45.9,23.65 v46.2,23.95
  Bottom 0.305: v46.2,23.95 49.65,27.35 49.65,29.77
PIND3
  Top 0.305: ITF_1.3 62.1,10 57.7,10 47.1,20.6 47.1,22.25 IC3.5
PIND4
  Top 0.305: ITF_2.4 72,9.35 70.6,10.85 57.85,10.85 48.4,20.2 48.4,21.09 IC3.6
PIND5
  Top 0.305: IC3.11 62.31,22.29 64,20.6 65.5,20.6 66.1,20 67.8,20 69.8,17.9 69.8,13.2 ITF_2.3
PIND6
  Top 0.305: IC3.12 66.53,20.6 68.1,20.6 70.43,18.12 70.43,13.47 73.7,10.2 74.8,10.2 ITF_2.2
PIND7
  Top 0.305: IC3.13 67.43,22.17 71.05,18.35 71.05,13.7 74,10.8 76.8,10.8 78,9.6 ITF_2.1
  Top 0.406: IC4.2 30.3,24 R2.2 30.3,24.55 30.85,25 64.76,24.95 IC3.13
PRESS  (via drill 0.6)
  Top 0.305: U2.4 69.05,38.3 v68.55,38.8
  Bottom 0.305: v68.55,38.8 59.8,38.8 59,39.6 PRESS.4
PUMP
  Top 0.305: 2.2 6.25,28.8 7.45,30 RN6.1
PUMP_MC
  Top 0.305: IC3.15 70.02,31.43 69.15,32.3 28.65,32.3 28.3,31.85 RN3.2
RESET
  Top 0.305: IC3.1 38.8,20.5 39.85,20.5 47.78,12.58 47.78,10.07 48.3,9.55 C16.2
  Top 0.61: RESET.B' 86.65,7.75 86.65,10.9 ISP.5
  Bottom 0.305: C1.2 72.6,18 71.5,18.85 39.48,18.85 37,20.95 IC3.1
  Bottom 0.406: D4.A 73.55,14.2 72.6,15.15 C1.2
  Bottom 0.61: ISP.5 77.5,15.9 R19.1 74.2,14.15 D4.A
RX
  Top 0.305: U1.1 78.28,31.32 78.95,30.55 RN8.4
SCK  (via drill 0.6)
  Top 0.254: 83.08,43.05 RN1.1
  Top 0.305: v80.3,43.05 83.08,43.05
  Bottom 0.305: ISP.3 80.95,19.25 83.15,19.25 83.85,19.85 83.85,23.65 82.9,24.65 80.6,24.65 80.3,25.05 80.3,34.45 | 80.3,34.45 60.9,34.45 60.9,31.5 59.85,31.05 IC3.19 | v80.3,43.05 80.3,34.45
SCL  (via drill 0.6)
  Top 0.305: RN2.4 67.3,40 67.55,40.25 U2.10 67.55,42.25 67,42.8 v63,42.8
  Bottom 0.305: I2C.2 23.65,46 26,43.45 LCD.4 26,40.2 26.5,39.7 36.35,39.7 37,40.35 | 37,40.35 LOADCELL.4 37.05,41.05 39.1,41.05 40.85,42.8 v63,42.8 | 37,40.35 37,30.01 IC3.28
SDA  (via drill 0.6)  (1 unrouted)
  Top 0.305: RN2.3 67.3,39.2 68.05,39.95 U2.9 68.05,42.55 66.75,43.85 v64.62,43.85 | LCD.3 24,39.85 24.65,39.25 34.4,39.25 | 34.4,39.25 34.95,39.85 34.95,40.95 LOADCELL.3 | v39.55,39.25 34.4,39.25
  Bottom 0.305: I2C.1 11.55,45.8 13.6,43.85 23.4,43.85 24,43.15 LCD.3 | 39.55,29.85 v39.55,39.25 | v64.62,43.85 40.4,43.85 38.8,42.2 36,42.2 LOADCELL.3
SPI_CS
  Top 0.305: IC3.25 44.62,28.57 43.3,27.6 23.15,27.6 21.5,25.9 21.5,21.35 22.05,20.8 D1.C
SPI_MISO  (1 unrouted)
  Top 0.305: IC3.26 42.08,28.58 41.55,28.25 22.65,28.25 20.8,26.3 20.8,14.4 | 20.8,14.44 IC1.7
SPI_SCK
  Top 0.305: IC3.24 47.16,28.46 45.05,26.95 23.65,26.95 22.2,25.45 22.2,21.75 D3.C
TX
  Top 0.305: U1.5 80.88,31.32 81.35,30.6 RN8.1
V+  (via drill 0.6)
  Top 0.406: IC2.3 23.45,5.35 24.45,4.4 | IC2.1 23.5,3.45 24.45,4.4 | v25.25,1.6 C13.2 24.5,4.35 24.45,4.4
  Bottom 0.406: v25.25,1.6 84.35,1.6 C7.A
  Bottom 0.61: +5_REG.3 | ALIM.2 98.5,11.4 98.5,45 arc90 95,48.5 37.9,48.5 36.55,47.25 V+.2
  Bottom 0.813: +5_REG.3 C7.A 92.25,7.3 94.75,9.8 ALIM.2
VOL
  Bottom 0.305: VOLUME.4 48,31.7 48.4,31.3 48.4,27.65 44.6,23.85 IC3.4
VUSB
  Bottom 0.813: D2.A C3.A 89.05,22.85 89.28,23.07 | 89.28,23.07 C4.2 | FUSE.1 86.95,25.4 89.28,23.07

### Text on the board
Document: V+ | SDA | SCL | AIN1 | SDA | SCL | FT232RL | CoffeeDuino | GND | +5v | GND | Reset | T+ | - | T- | + | TC | PIND7
tDocu: PC0 | AIN0 | ATMEGA328PU | DS1820 | +5v | DTR | RX | TX | PINC0 | PIND3 | +5v | GND | PIND4 | PIND5 | PIND6 | PIND7
bDocu: PC0 | AIN0 | CoffeeDuino | ATMEGA328PU | +5v | RX | TX | DTR | PINC0 | PIND3 | +5v | GND | PIND4 | PIND5 | PIND6 | PIND7